# EAGLE design 1.0mm + 0.5mm FPC stick (EAGLE 6.3)
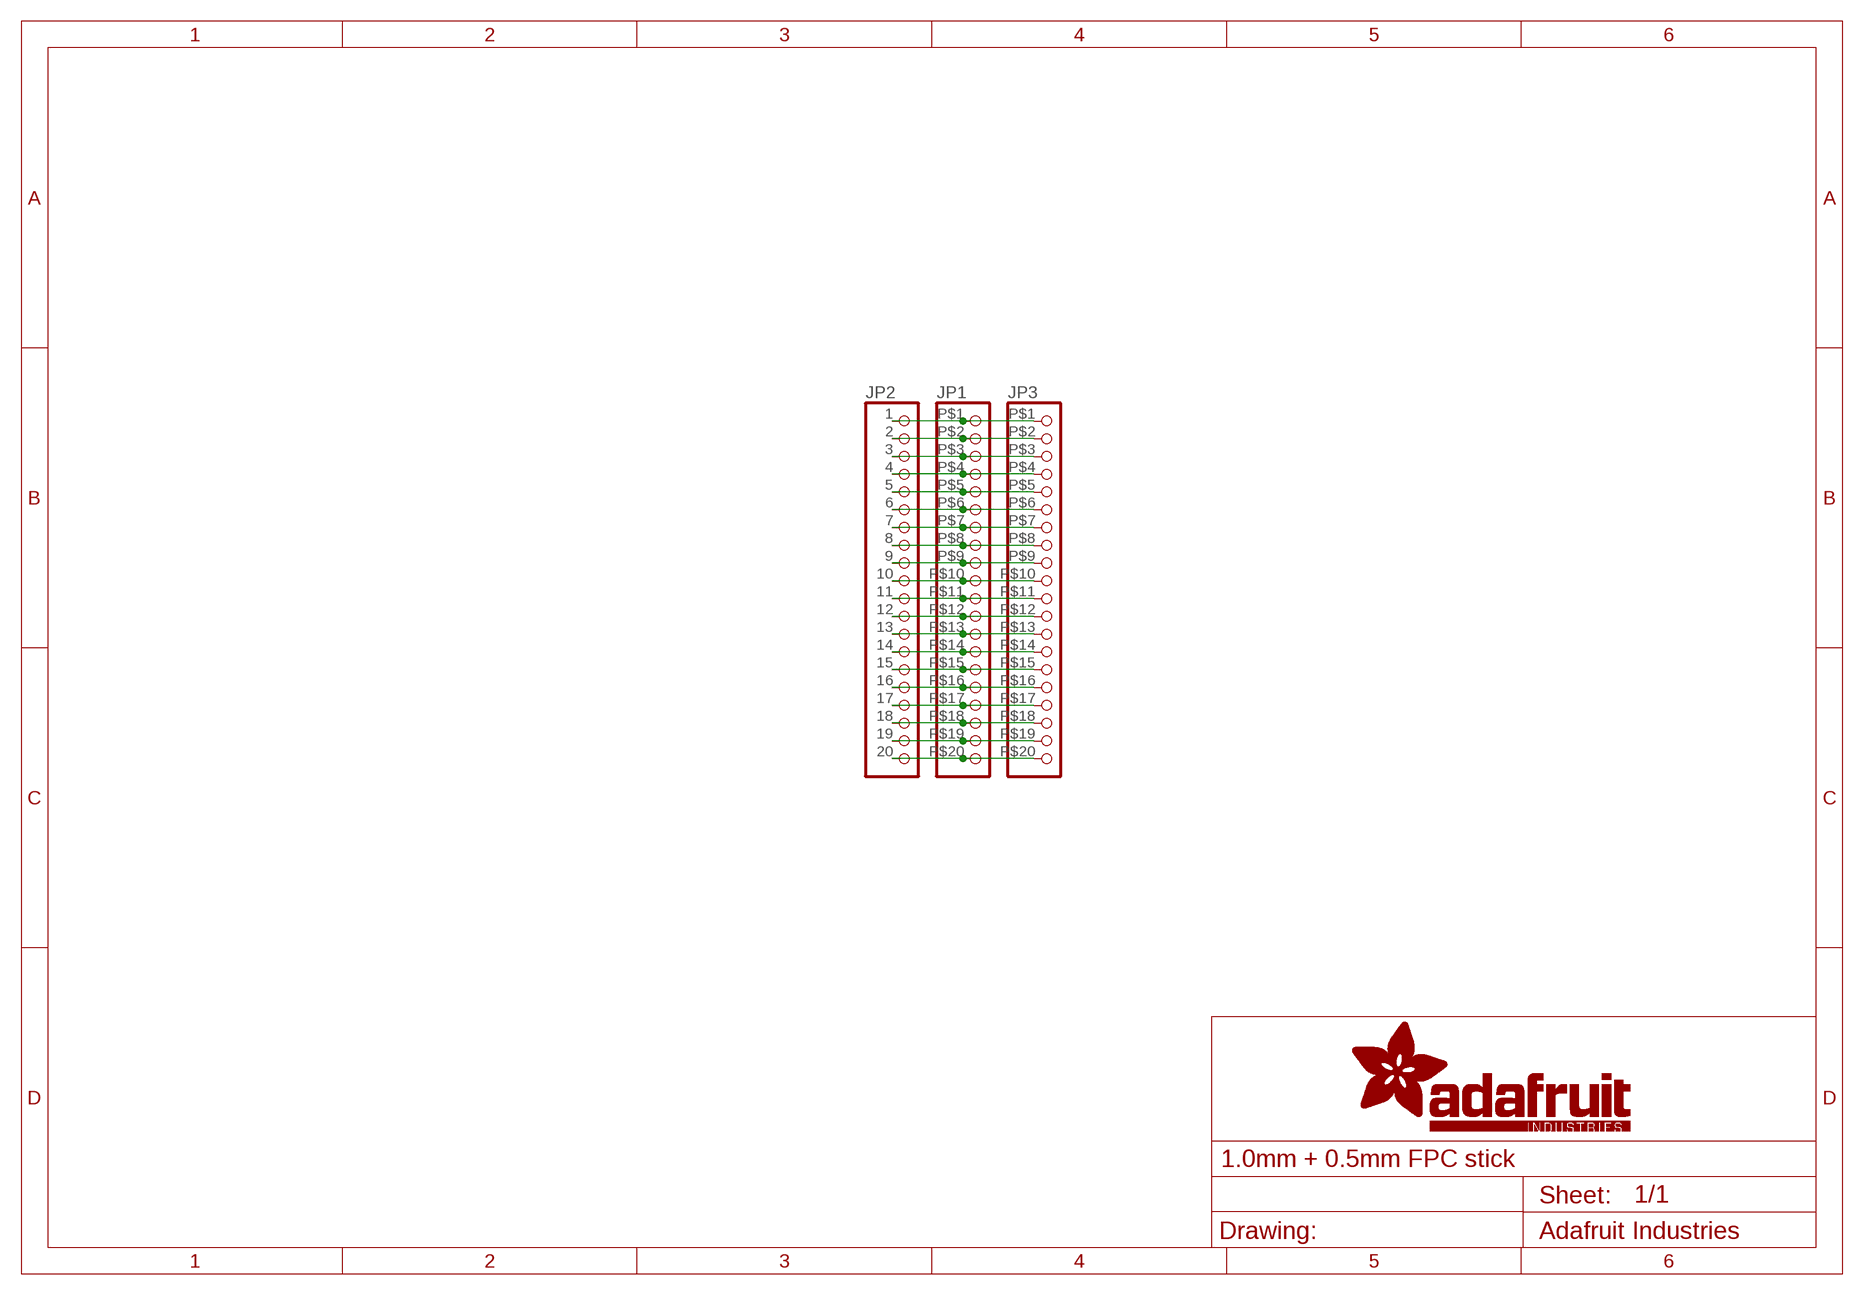
[diagram p0: schematic, sheet 1]

## Parts
JP1  HEADER-1X20FPC_1.0MM  [FPC_GENERIC_1.0MM_20PIN]
JP2  HEADER-1X20ROUND  [1X20_ROUND]
JP3  HEADER-1X20FPC_0.5MM  [FPC_GENERIC_0.5MM_20PIN]

## Nets
N$1: JP1.P$1 JP2.1 JP3.P$1
N$2: JP1.P$2 JP2.2 JP3.P$2
N$3: JP1.P$3 JP2.3 JP3.P$3
N$4: JP1.P$4 JP2.4 JP3.P$4
N$5: JP1.P$5 JP2.5 JP3.P$5
N$6: JP1.P$6 JP2.6 JP3.P$6
N$7: JP1.P$7 JP2.7 JP3.P$7
N$8: JP1.P$8 JP2.8 JP3.P$8
N$9: JP1.P$9 JP2.9 JP3.P$9
N$10: JP1.P$10 JP2.10 JP3.P$10
N$11: JP1.P$11 JP2.11 JP3.P$11
N$12: JP1.P$12 JP2.12 JP3.P$12
N$13: JP1.P$13 JP2.13 JP3.P$13
N$14: JP1.P$14 JP2.14 JP3.P$14
N$15: JP1.P$15 JP2.15 JP3.P$15
N$16: JP1.P$16 JP2.16 JP3.P$16
N$17: JP1.P$17 JP2.17 JP3.P$17
N$18: JP1.P$18 JP2.18 JP3.P$18
N$19: JP1.P$19 JP2.19 JP3.P$19
N$20: JP1.P$20 JP2.20 JP3.P$20

## Library data of the parts
JP1-JP3 = microbuilder:HEADER-1X20

## Board
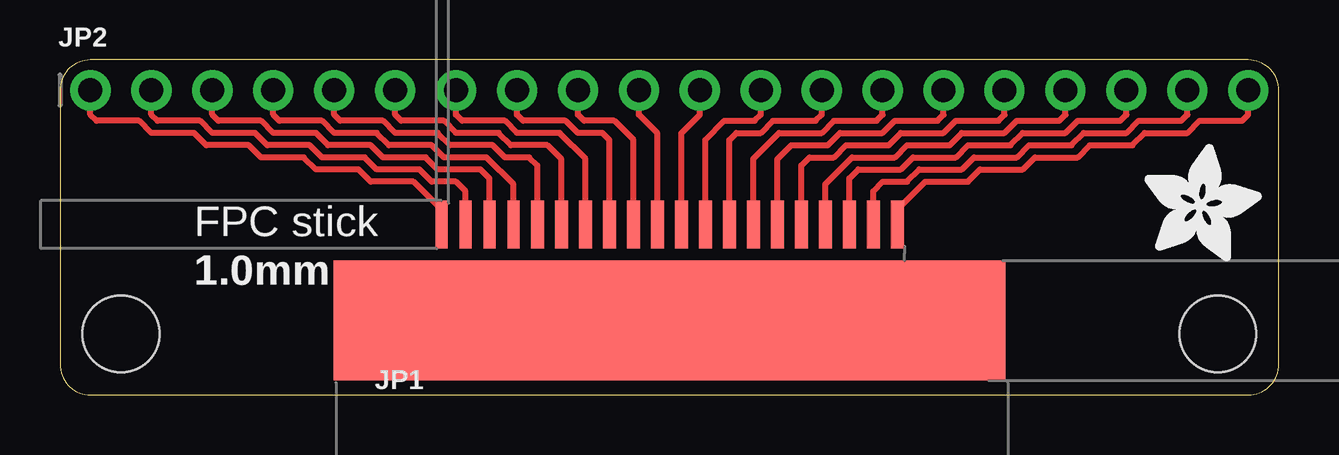
[diagram p1: board, top side]
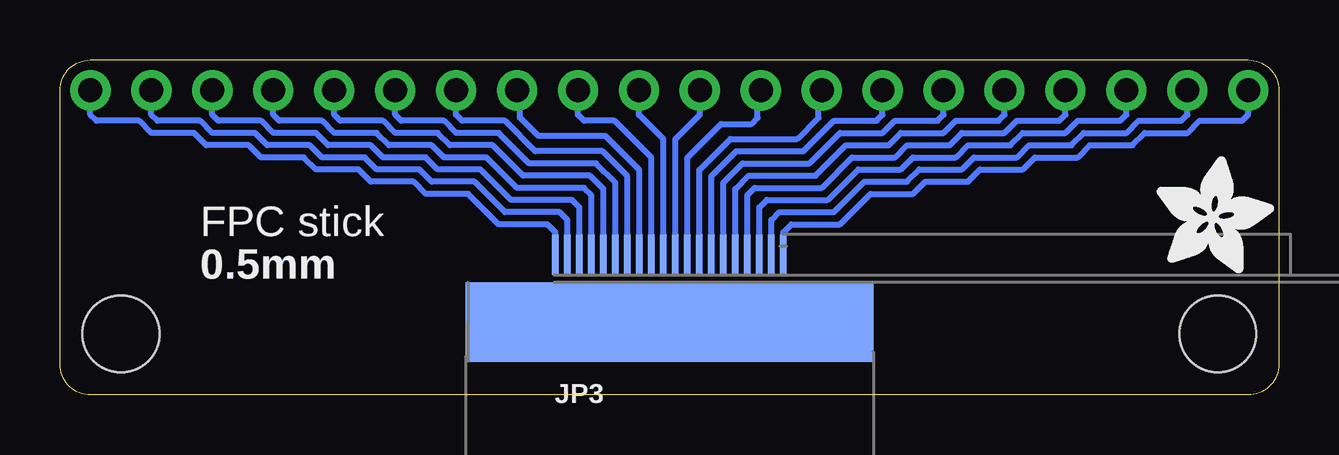
[diagram p2: board, bottom side, seen from below]

Size 50.8 x 13.97 mm. Coordinates in mm from the lower left corner, seen from the top.
Outline: 1.27,0 49.53,0 arc90 50.8,1.27 50.8,12.7 arc90 49.53,13.97 1.27,13.97 arc90 0,12.7 0,1.27 arc90 1.27,0
Copper layers (1*16): Top 0.035mm / dielectric 1.5mm / Bottom 0.035mm
Design rules "adafruit": minimum track width 8mil, minimum drill 16mil, track to track 8mil, track to pad 8mil, pad to pad 8mil, via to via 8mil, smd to smd 8mil, copper to edge 10mil, drill to drill 8mil, minimum pad ring 10mil, minimum via ring 8mil, stop-mask expansion 4mil, vias tented up to drill 20mil, thermal gap 10mil
Holes 3.2 mm at 2.54,2.54 48.26,2.54

### Footprints (pad centres in the part's own frame; a part is rotated, then mirrored left to right if it is on the bottom)
FPC_GENERIC_1.0MM_20PIN = smd 0.5 x 2: P$1 -9.5,0; P$2 -8.5,0; P$3 -7.5,0; P$4 -6.5,0 | smd 0.55 x 2: P$5 -5.5,0; P$6 -4.5,0; P$7 -3.5,0; P$8 -2.5,0; P$9 -1.5,0; P$10 -0.5,0; P$11 0.5,0; P$12 1.5,0; P$13 2.5,0; P$14 3.5,0; P$15 4.5,0; P$16 5.5,0; P$17 6.5,0; P$18 7.5,0; P$19 8.5,0; P$20 9.5,0 | smd 28 x 5: SUPPORT 0,-4
1X20_ROUND = drill 1 pad 1.676: 1 -24.13,0; 2 -21.59,0; 3 -19.05,0; 4 -16.51,0; 5 -13.97,0; 6 -11.43,0; 7 -8.89,0; 8 -6.35,0; 9 -3.81,0; 10 -1.27,0; 11 1.27,0; 12 3.81,0; 13 6.35,0; 14 8.89,0; 15 11.43,0; 16 13.97,0; 17 16.51,0; 18 19.05,0; 19 21.59,0; 20 24.13,0
FPC_GENERIC_0.5MM_20PIN = smd 0.28 x 1.7: P$1 4.75,3.81; P$2 4.25,3.81; P$3 3.75,3.81; P$4 3.25,3.81; P$5 2.75,3.81; P$6 2.25,3.81; P$7 1.75,3.81; P$8 1.25,3.81; P$9 0.75,3.81; P$10 0.25,3.81; P$11 -0.25,3.81; P$12 -0.75,3.81; P$13 -1.25,3.81; P$14 -1.75,3.81; P$15 -2.25,3.81; P$16 -2.75,3.81; P$17 -3.25,3.81; P$18 -3.75,3.81; P$19 -4.25,3.81; P$20 -4.75,3.81 | smd 17 x 3.3: SUPPORT 0,1

### Placement (x,y rotation side)
JP1  25.4,7.11 0 top
JP2  25.4,12.7 0 top
JP3  25.4,2.03 0 bottom
U$2  [ADAFRUIT_5MM]  45.21,5.59 0 top
U$3  [ADAFRUIT_5MM]  5.08,5.08 0 bottom

### Tracks (layer width: path | path; a pad name or v marks a point on that pad's centre or on a via)
N$1
  Top 0.254: JP1.P$1 15.9,7.72 14.73,8.89 12.95,8.89 12.45,9.4 10.67,9.4 10.16,9.91 8.38,9.91 7.87,10.41 6.1,10.41 5.59,10.92 3.81,10.92 3.3,11.43 1.52,11.43 1.27,11.68 JP2.1
  Bottom 0.254: JP3.P$1 20.65,6.78 20.32,7.11 18.29,7.11 17.02,8.38 15.24,8.38 14.73,8.89 12.95,8.89 12.45,9.4 10.67,9.4 10.16,9.91 8.38,9.91 7.87,10.41 6.1,10.41 5.59,10.92 3.81,10.92 3.3,11.43 1.52,11.43 1.27,11.68 JP2.1
N$2
  Top 0.254: JP1.P$2 16.9,8.5 16.51,8.89 15.49,8.89 14.99,9.4 13.21,9.4 12.7,9.91 10.92,9.91 10.41,10.41 8.64,10.41 8.13,10.92 6.35,10.92 5.84,11.43 4.06,11.43 3.81,11.68 JP2.2
  Bottom 0.254: JP3.P$2 21.15,7.3 20.83,7.62 18.54,7.62 17.27,8.89 15.49,8.89 14.99,9.4 13.21,9.4 12.7,9.91 10.92,9.91 10.41,10.41 8.64,10.41 8.13,10.92 6.35,10.92 5.84,11.43 4.06,11.43 3.81,11.68 JP2.2
N$3
  Top 0.254: JP1.P$3 17.9,9.02 17.53,9.4 15.75,9.4 15.24,9.91 13.46,9.91 12.95,10.41 11.18,10.41 10.67,10.92 8.89,10.92 8.38,11.43 6.6,11.43 6.35,11.68 JP2.3
  Bottom 0.254: JP3.P$3 21.65,7.81 21.34,8.13 18.8,8.13 17.53,9.4 15.75,9.4 15.24,9.91 13.46,9.91 12.95,10.41 11.18,10.41 10.67,10.92 8.89,10.92 8.38,11.43 6.6,11.43 6.35,11.68 JP2.3
N$4
  Top 0.254: JP1.P$4 18.9,8.79 17.78,9.91 16,9.91 15.49,10.41 13.72,10.41 13.21,10.92 11.43,10.92 10.92,11.43 9.14,11.43 8.89,11.68 JP2.4
  Bottom 0.254: JP3.P$4 22.15,8.33 21.84,8.64 19.05,8.64 17.78,9.91 16,9.91 15.49,10.41 13.72,10.41 13.21,10.92 11.43,10.92 10.92,11.43 9.14,11.43 8.89,11.68 JP2.4
N$5
  Top 0.254: JP1.P$5 19.9,9.56 19.56,9.91 18.54,9.91 18.03,10.41 16.26,10.41 15.75,10.92 13.97,10.92 13.46,11.43 11.68,11.43 11.43,11.68 JP2.5
  Bottom 0.254: JP3.P$5 22.65,8.59 22.1,9.14 19.3,9.14 18.03,10.41 16.26,10.41 15.75,10.92 13.97,10.92 13.46,11.43 11.68,11.43 11.43,11.68 JP2.5
N$6
  Top 0.254: JP1.P$6 20.9,9.83 20.32,10.41 18.8,10.41 18.29,10.92 16.51,10.92 16,11.43 14.22,11.43 13.97,11.68 JP2.6
  Bottom 0.254: JP3.P$6 23.15,8.85 22.35,9.65 19.56,9.65 18.29,10.92 16.51,10.92 16,11.43 14.22,11.43 13.97,11.68 JP2.6
N$7
  Top 0.254: JP1.P$7 21.9,9.85 20.83,10.92 19.05,10.92 18.54,11.43 16.76,11.43 16.51,11.68 JP2.7
  Bottom 0.254: JP3.P$7 23.65,9.12 22.61,10.16 19.81,10.16 18.54,11.43 16.76,11.43 16.51,11.68 JP2.7
N$8
  Top 0.254: JP1.P$8 22.9,10.63 22.61,10.92 21.59,10.92 21.08,11.43 19.3,11.43 19.05,11.68 JP2.8
  Bottom 0.254: JP3.P$8 24.15,9.38 22.86,10.67 20.07,10.67 19.18,11.56 19.18,12.57 JP2.8
N$9
  Top 0.254: JP1.P$9 23.9,10.64 23.11,11.43 21.84,11.43 21.59,11.68 JP2.9
  Bottom 0.254: JP3.P$9 24.65,9.89 23.24,11.3 21.97,11.3 21.72,11.56 21.72,12.57 JP2.9
N$10
  Top 0.254: JP1.P$10 24.9,10.91 24.13,11.68 JP2.10
  Bottom 0.254: JP3.P$10 25.15,10.66 24.13,11.68 JP2.10
N$11
  Top 0.254: JP1.P$11 25.9,10.91 26.67,11.68 JP2.11
  Bottom 0.254: JP3.P$11 25.65,10.66 26.67,11.68 JP2.11
N$12
  Top 0.254: JP1.P$12 26.9,10.64 27.69,11.43 28.96,11.43 29.21,11.68 JP2.12
  Bottom 0.254: JP3.P$12 26.15,9.89 27.69,11.43 28.96,11.43 29.21,11.68 JP2.12
N$13
  Top 0.254: JP1.P$13 27.9,10.63 28.19,10.92 29.21,10.92 29.72,11.43 31.5,11.43 31.75,11.68 JP2.13
  Bottom 0.254: JP3.P$13 26.65,9.38 28.07,10.79 30.86,10.79 31.62,11.56 31.62,12.57 JP2.13
N$14
  Top 0.254: JP1.P$14 28.9,9.85 29.97,10.92 31.75,10.92 32.26,11.43 34.04,11.43 34.29,11.68 JP2.14
  Bottom 0.254: JP3.P$14 27.15,9.12 28.19,10.16 30.99,10.16 32.26,11.43 34.04,11.43 34.29,11.68 JP2.14
N$15
  Top 0.254: JP1.P$15 29.9,9.83 30.48,10.41 32,10.41 32.51,10.92 34.29,10.92 34.8,11.43 36.58,11.43 36.83,11.68 JP2.15
  Bottom 0.254: JP3.P$15 27.65,8.85 28.45,9.65 31.24,9.65 32.51,10.92 34.29,10.92 34.8,11.43 36.58,11.43 36.83,11.68 JP2.15
N$16
  Top 0.254: JP1.P$16 30.9,9.56 31.24,9.91 32.26,9.91 32.77,10.41 34.54,10.41 35.05,10.92 36.83,10.92 37.34,11.43 39.12,11.43 39.37,11.68 JP2.16
  Bottom 0.254: JP3.P$16 28.15,8.59 28.7,9.14 31.5,9.14 32.77,10.41 34.54,10.41 35.05,10.92 36.83,10.92 37.34,11.43 39.12,11.43 39.37,11.68 JP2.16
N$17
  Top 0.254: JP1.P$17 31.9,8.79 33.02,9.91 34.8,9.91 35.31,10.41 37.08,10.41 37.59,10.92 39.37,10.92 39.88,11.43 41.66,11.43 41.91,11.68 JP2.17
  Bottom 0.254: JP3.P$17 28.65,8.33 28.96,8.64 31.75,8.64 33.02,9.91 34.8,9.91 35.31,10.41 37.08,10.41 37.59,10.92 39.37,10.92 39.88,11.43 41.66,11.43 41.91,11.68 JP2.17
N$18
  Top 0.254: JP1.P$18 32.9,9.02 33.27,9.4 35.05,9.4 35.56,9.91 37.34,9.91 37.85,10.41 39.62,10.41 40.13,10.92 41.91,10.92 42.42,11.43 44.2,11.43 44.45,11.68 JP2.18
  Bottom 0.254: JP3.P$18 29.15,7.81 29.46,8.13 32,8.13 33.27,9.4 35.05,9.4 35.56,9.91 37.34,9.91 37.85,10.41 39.62,10.41 40.13,10.92 41.91,10.92 42.42,11.43 44.2,11.43 44.45,11.68 JP2.18
N$19
  Top 0.254: JP1.P$19 33.9,8.5 34.29,8.89 35.31,8.89 35.81,9.4 37.59,9.4 38.1,9.91 39.88,9.91 40.39,10.41 42.16,10.41 42.67,10.92 44.45,10.92 44.96,11.43 46.74,11.43 46.99,11.68 JP2.19
  Bottom 0.254: JP3.P$19 29.65,7.3 29.97,7.62 32.26,7.62 33.53,8.89 35.31,8.89 35.81,9.4 37.59,9.4 38.1,9.91 39.88,9.91 40.39,10.41 42.16,10.41 42.67,10.92 44.45,10.92 44.96,11.43 46.74,11.43 46.99,11.68 JP2.19
N$20
  Top 0.254: JP1.P$20 34.9,7.72 36.07,8.89 37.85,8.89 38.35,9.4 40.13,9.4 40.64,9.91 42.42,9.91 42.93,10.41 44.7,10.41 45.21,10.92 46.99,10.92 47.5,11.43 49.28,11.43 49.53,11.68 JP2.20
  Bottom 0.254: JP3.P$20 30.15,6.78 30.48,7.11 32.51,7.11 33.78,8.38 35.56,8.38 36.07,8.89 37.85,8.89 38.35,9.4 40.13,9.4 40.64,9.91 42.42,9.91 42.93,10.41 44.7,10.41 45.21,10.92 46.99,10.92 47.5,11.43 49.28,11.43 49.53,11.68 JP2.20

### Text on the board
tPlace: FPC stick | 1.0mm
bPlace: FPC stick | 0.5mm